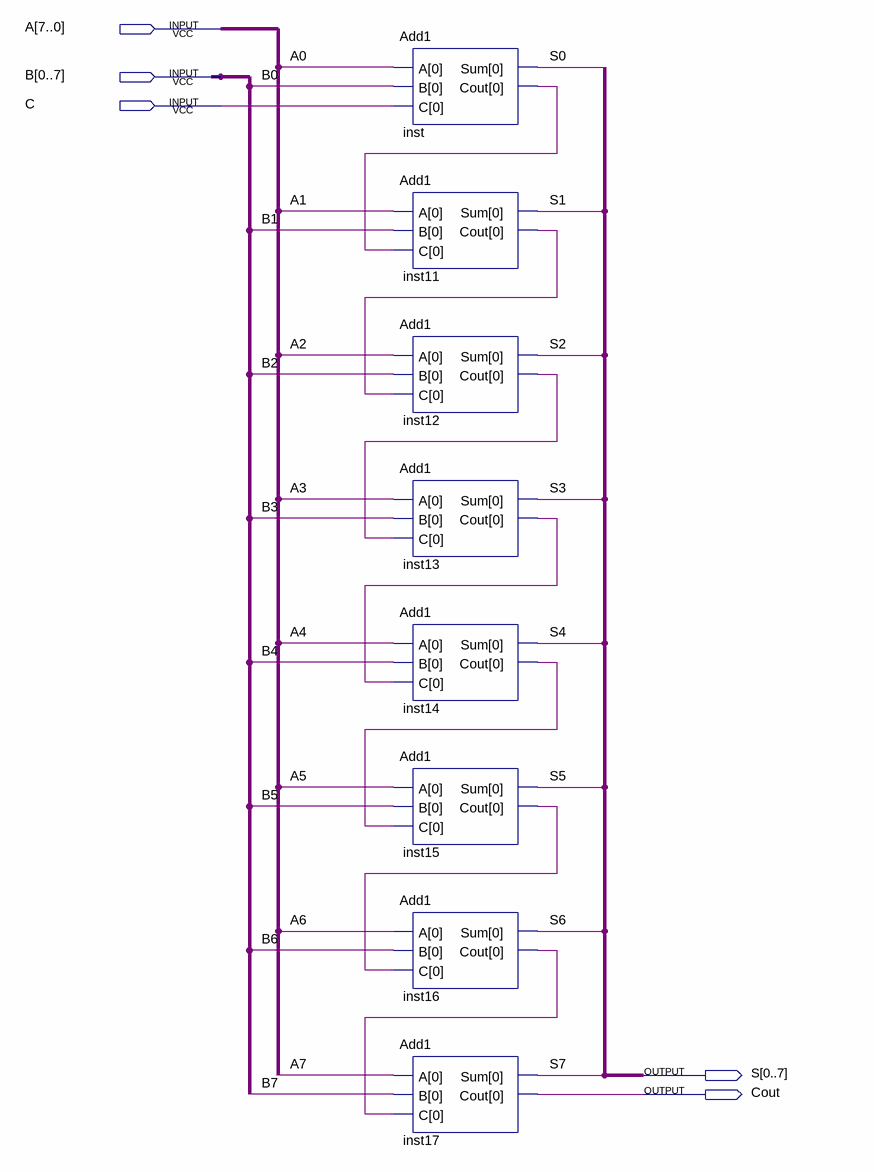
[diagram p0: schematic sheet]
// Quartus schematic Add8.bdf as structural Verilog: 8 symbols, 5 pins
module Add8 (
  input  [7:0] A,
  input  [0:7] B,
  input  C,
  output [0:7] S,
  output Cout
);

  wire inst11_cout, inst12_cout, inst13_cout, inst14_cout, inst15_cout, inst16_cout, inst_cout;

  Add1 inst (.A(A[0]), .B(B[0]), .C(C), .Sum(S[0]), .Cout(inst_cout));
  Add1 inst11 (.A(A[1]), .B(B[1]), .C(inst_cout), .Sum(S[1]), .Cout(inst11_cout));
  Add1 inst12 (.A(A[2]), .B(B[2]), .C(inst11_cout), .Sum(S[2]), .Cout(inst12_cout));
  Add1 inst13 (.A(A[3]), .B(B[3]), .C(inst12_cout), .Sum(S[3]), .Cout(inst13_cout));
  Add1 inst14 (.A(A[4]), .B(B[4]), .C(inst13_cout), .Sum(S[4]), .Cout(inst14_cout));
  Add1 inst15 (.A(A[5]), .B(B[5]), .C(inst14_cout), .Sum(S[5]), .Cout(inst15_cout));
  Add1 inst16 (.A(A[6]), .B(B[6]), .C(inst15_cout), .Sum(S[6]), .Cout(inst16_cout));
  Add1 inst17 (.A(A[7]), .B(B[7]), .C(inst16_cout), .Sum(S[7]), .Cout(Cout));
endmodule
